# Altium schematic sheet Gagabiro_main.SchDoc
size 393 x 281 mm; SheetNumber: 2; SheetTotal: 4
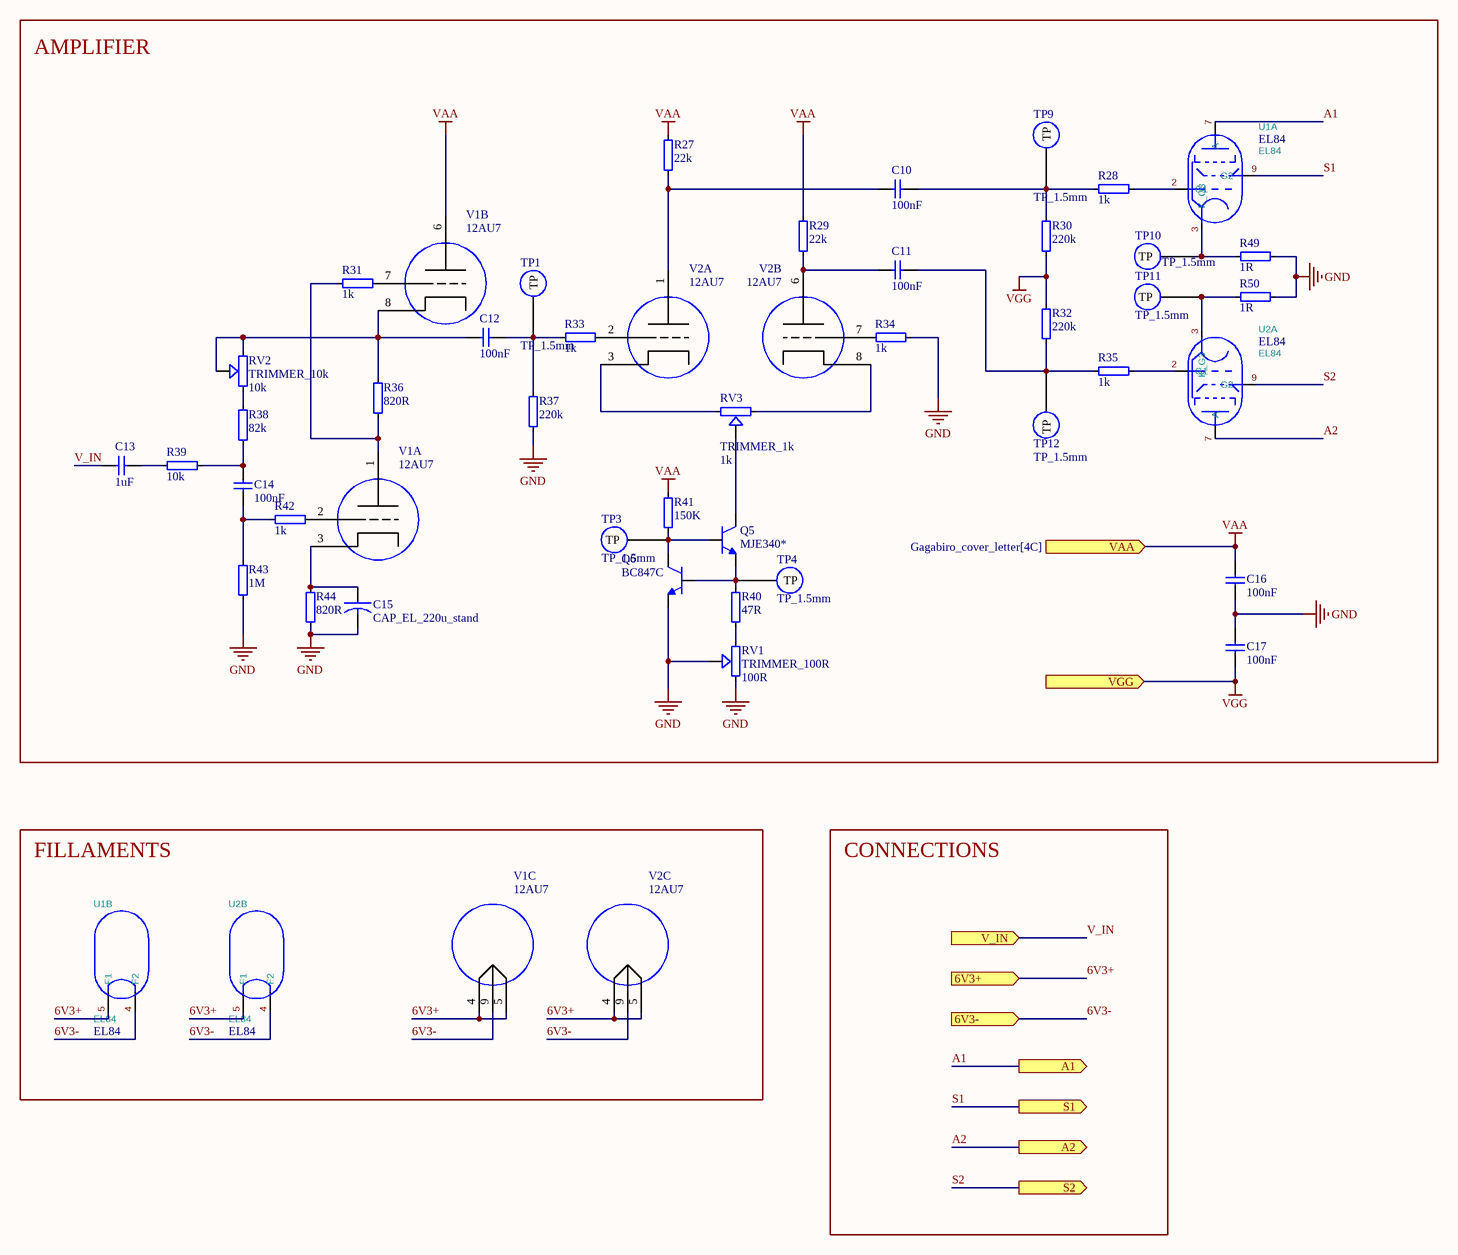
[diagram p0: Gagabiro_main.SchDoc]

## Parts
C10  100nF  [CAP_panassonic_100n_450V]
C11  100nF  [CAP_panassonic_100n_450V]
C12  100nF  [CAP_panassonic_100n_450V]
C13  1uF  [CAP_panassonic_1u_450V]
C14  100nF  [CAP_panassonic_100n_450V]
C15  CAP_EL_220u_stand  [CAPPRD500W50D630H1120_stand]
C16  100nF  [CAP_panassonic_100n_450V]
C17  100nF  [CAP_panassonic_100n_450V]
Q5  MJE340*  [TO126]
Q6  BC847C  [TRANS_BC847C]
R27  22k  [RES_2W_vertical]
R28  1k  [RES_2W_vertical]
R29  22k  [RES_2W_vertical]
R30  220k  [RES_2W_vertical]
R31  1k  [RES_2W_vertical]
R32  220k  [RES_2W_vertical]
R33  1k  [RES_2W_vertical]
R34  1k  [RES_2W_vertical]
R35  1k  [RES_2W_vertical]
R36  820R  [RES_2W_vertical]
R37  220k  [RES_2W_vertical]
R38  82k  [RES_2W_vertical]
R39  10k  [RES_2W_vertical]
R40  47R  [RES_2W_vertical]
R41  150K  [RES_2W_vertical]
R42  1k  [RES_2W_vertical]
R43  1M  [RES_2W_vertical]
R44  820R  [RES_2W_vertical]
R49  1R  [RES_2W_vertical]
R50  1R  [RES_2W_vertical]
RV1  TRIMMER_100R  value 100R  [TRIM_PV36W204C01B00 - duplicate]
RV2  TRIMMER_10k  value 10k  [TRIM_PV36W204C01B00 - duplicate]
RV3  TRIMMER_1k  value 1k  [TRIM_PV36W204C01B00 - duplicate]
TP1  TP_1.5mm  [test_point_1.5mm]
TP3  TP_1.5mm  [test_point_1.5mm]
TP4  TP_1.5mm  [test_point_1.5mm]
TP9  TP_1.5mm  [test_point_1.5mm]
TP10  TP_1.5mm  [test_point_1.5mm]
TP11  TP_1.5mm  [test_point_1.5mm]
TP12  TP_1.5mm  [test_point_1.5mm]
U1  EL84  [EL84]  (parts A,B of 2)
U2  EL84  [EL84]  (parts A,B of 2)
V1  12AU7  [12A_7]  (parts A,B,C of 3)
V2  12AU7  [12A_7]  (parts A,B,C of 3)

## Blocks framed on the sheet
AMPLIFIER: C10-C17 Q5 Q6 R27-R44 R49 R50 RV1-RV3 TP1 TP3 TP4 TP9-TP12 U1 U2 V1 V2
FILLAMENTS: U1 U2 V1 V2

## Ports
6V3+ (in, see Gagabiro_cover_letter[4C], Gagabiro_mechanical[2B]), 6V3- (in, see Gagabiro_cover_letter[4C], Gagabiro_mechanical[2B]), A1 (out, see Gagabiro_cover_letter[4C]), A2 (out, see Gagabiro_cover_letter[4C]), S1 (out, see Gagabiro_cover_letter[4C]), S2 (out, see Gagabiro_cover_letter[4C]), V_IN (in, see Gagabiro_cover_letter[4C]), VAA (in, see Gagabiro_cover_letter[4C]), VGG (in, see Gagabiro_cover_letter[4C], Gagabiro_power_supply[2D])

## Nets
GND: C15.N C16.1 C17.1 Q6.2(E) R34.2 R37.1 R43.1 R44.1 R49.2 R50.2 RV1.1 RV1.2
VAA: C16.2 R27.2 R29.2 R41.2 V1.6 ; port VAA
VGG: C17.2 R30.1 R32.1 ; port VGG
6V3+: U1.5(F1) U2.5(F1) V1.4 V1.5 V2.4 V2.5 ; port 6V3+
6V3-: U1.4(F2) U2.4(F2) V1.9 V2.9 ; port 6V3-
A1: U1.7(A) ; port A1
A2: U2.7(A) ; port A2
S1: U1.9(G2) ; port S1
S2: U2.9(G2) ; port S2
V_IN: C13.1 ; port V_IN
NetC10_1: C10.1 R27.1 V2.1
NetC10_2: C10.2 R28.1 R30.2 TP9.1(TP)
NetC11_1: C11.1 R29.1 V2.6
NetC11_2: C11.2 R32.2 R35.1 TP12.1(TP)
NetC12_1: C12.1 R36.2 RV2.2 RV2.3 V1.8
NetC12_2: C12.2 R33.1 R37.2 TP1.1(TP)
NetC13_2: C13.2 R39.1
NetC14_1: C14.1 R42.1 R43.2
NetC14_2: C14.2 R38.1 R39.2
NetC15_P: C15.P R44.2 V1.3
NetQ5_1: Q5.1(E) Q6.1(B) R40.2 TP4.1(TP)
NetQ5_2: Q5.2(C) RV3.2
NetQ5_3: Q5.3(B) Q6.3(C) R41.1 TP3.1(TP)
NetR28_2: R28.2 U1.2(G1)
NetR31_1: R31.1 R36.1 V1.1
NetR31_2: R31.2 V1.7
NetR33_2: R33.2 V2.2
NetR34_1: R34.1 V2.7
NetR35_2: R35.2 U2.2(G1)
NetR38_2: R38.2 RV2.1
NetR40_1: R40.1 RV1.3
NetR42_2: R42.2 V1.2
NetR49_1: R49.1 TP10.1(TP) U1.3(K_G3)
NetR50_1: R50.1 TP11.1(TP) U2.3(K_G3)
NetRV3_1: RV3.1 V2.8
NetRV3_3: RV3.3 V2.3

## Notes on the sheet
- CONNECTIONS
- Title:
- Drawn By:
- Size:
- Date:
- File:
- A3
- Number:
- Time:
- Revision:
- Sheet
- of
- Website:

## Library data of the parts
C10-C12 C14 C16 C17 = CAP_POLY_100n: Capacitor, Silver Mica; Part Number: CMICA_47PF; Value: 100nF
C13 = CAP_POLY_1u: Capacitor, Silver Mica; Part Number: CMICA_47PF; Value: 1uF
C15 = CAP_EL_220u_stand: 220F 16V Aluminum Electrolytic Capacitors Radial, Can 1000 Hrs @ 105C; MP: EEU-HD1C221B; Value: 220uF; MF: Panasonic; Availability: In Stock; Purchase-URL: https://pricing.snapeda.com/search/part/EEU-HD1C221B/?ref=eda; Package: RADIAL-2 Panasonic; Check_prices: https://www.snapeda.com/parts/EEU-HD1C221B/Panasonic/view-part/?ref=eda; SnapEDA_Link: https://www.snapeda.com/parts/EEU-HD1C221B/Panasonic/view-part/?ref=snap; Price: None
Q5 = MJE340*: Bipolar (BJT) Transistor NPN 300 V 500 mA - 20.8 W Through Hole SOT-32-3; MF: STMicroelectronics; MP: MJE340; SnapEDA_Link: https://www.snapeda.com/parts/MJE340/STMicroelectronics/view-part/?ref=snap; Package: TO-126-3 Motorola; Value: *; Check_prices: https://www.snapeda.com/parts/MJE340/STMicroelectronics/view-part/?ref=eda
Q6 = BC847C: Bipolar (BJT) Transistor NPN 45 V 100 mA 300MHz 250 mW Surface Mount SOT-23-3 (TO-236); MF: Diotec Semiconductor; Price: None; SnapEDA_Link: https://www.snapeda.com/parts/BC847C/Diotec/view-part/?ref=snap; Purchase-URL: https://pricing.snapeda.com/search/part/BC847C/?ref=eda; Availability: In Stock; MP: BC847C; Package: SOT-23-3 Diotec; Check_prices: https://www.snapeda.com/parts/BC847C/Diotec/view-part/?ref=eda; Value: *
R27 R29 = R_2W_vertical_22k: Resistor, 2W; Part Number: R2W; ComponentLink1URL: N.A.; ComponentLink1Description: Datasheet; ComponentLink2URL: N.A.; ComponentLink2Description: Supplier link; Author: colombari; Value: 22k
R28 R31 R33-R35 R42 = R_2W_vertical_1k: Resistor, 2W; Part Number: R2W; ComponentLink1URL: N.A.; ComponentLink1Description: Datasheet; ComponentLink2URL: N.A.; ComponentLink2Description: Supplier link; Author: colombari; Value: 1k
R30 R32 R37 = R_2W_vertical_220k: Resistor, 2W; Part Number: R2W; ComponentLink1URL: N.A.; ComponentLink1Description: Datasheet; ComponentLink2URL: N.A.; ComponentLink2Description: Supplier link; Author: colombari; Value: 220k
R36 R44 = R_2W_vertical_820R: Resistor, 2W; Part Number: R2W; ComponentLink1URL: N.A.; ComponentLink1Description: Datasheet; ComponentLink2URL: N.A.; ComponentLink2Description: Supplier link; Author: colombari; Value: 820R
R38 = R_2W_vertical_82k: Resistor, 2W; Part Number: R2W; ComponentLink1URL: N.A.; ComponentLink1Description: Datasheet; ComponentLink2URL: N.A.; ComponentLink2Description: Supplier link; Author: colombari; Value: 82k
R39 = R_2W_vertical_10k: Resistor, 2W; Part Number: R2W; ComponentLink1URL: N.A.; ComponentLink1Description: Datasheet; ComponentLink2URL: N.A.; ComponentLink2Description: Supplier link; Author: colombari; Value: 10k
R40 = R_2W_vertical_47R: Resistor, 2W; Part Number: R2W; ComponentLink1URL: N.A.; ComponentLink1Description: Datasheet; ComponentLink2URL: N.A.; ComponentLink2Description: Supplier link; Author: colombari; Value: 47R
R41 = R_2W_vertical_150K: Resistor, 2W; Part Number: R2W; ComponentLink1URL: N.A.; ComponentLink1Description: Datasheet; ComponentLink2URL: N.A.; ComponentLink2Description: Supplier link; Author: colombari; Value: 150K
R43 = R_2W_vertical_1M: Resistor, 2W; Part Number: R2W; ComponentLink1URL: N.A.; ComponentLink1Description: Datasheet; ComponentLink2URL: N.A.; ComponentLink2Description: Supplier link; Author: colombari; Value: 1M
R49 R50 = R_2W_vertical_1R: Resistor, 2W; Part Number: R2W; ComponentLink1URL: N.A.; ComponentLink1Description: Datasheet; ComponentLink2URL: N.A.; ComponentLink2Description: Supplier link; Author: colombari; Value: 1R
RV1 = TRIMMER_100R: TRIMMER; MF: Bourns Electronics; MP: PV36W204C01B00.; SnapEDA_Link: https://www.snapeda.com/parts/PV36W204C01B00./Bourns/view-part/?ref=snap; Package: None; Check_prices: https://www.snapeda.com/parts/PV36W204C01B00./Bourns/view-part/?ref=eda
RV2 = TRIMMER_10k: TRIMMER; MF: Bourns Electronics; MP: PV36W204C01B00.; SnapEDA_Link: https://www.snapeda.com/parts/PV36W204C01B00./Bourns/view-part/?ref=snap; Package: None; Check_prices: https://www.snapeda.com/parts/PV36W204C01B00./Bourns/view-part/?ref=eda
RV3 = TRIMMER_1k: TRIMMER; MF: Bourns Electronics; MP: PV36W204C01B00.; SnapEDA_Link: https://www.snapeda.com/parts/PV36W204C01B00./Bourns/view-part/?ref=snap; Package: None; Check_prices: https://www.snapeda.com/parts/PV36W204C01B00./Bourns/view-part/?ref=eda
V1 V2 = 12AU7: TUNGSOL 12AU7 NEW PRD PREAMP TB; MF: RCA; MP: 12AX7; SnapEDA_Link: https://www.snapeda.com/parts/12AX7/RCA/view-part/?ref=snap; Package: None; Check_prices: https://www.snapeda.com/parts/12AX7/RCA/view-part/?ref=eda; Value: *
U1 U2 = EL84: Footprint: Valve:Valve_Noval_P; Value: EL84